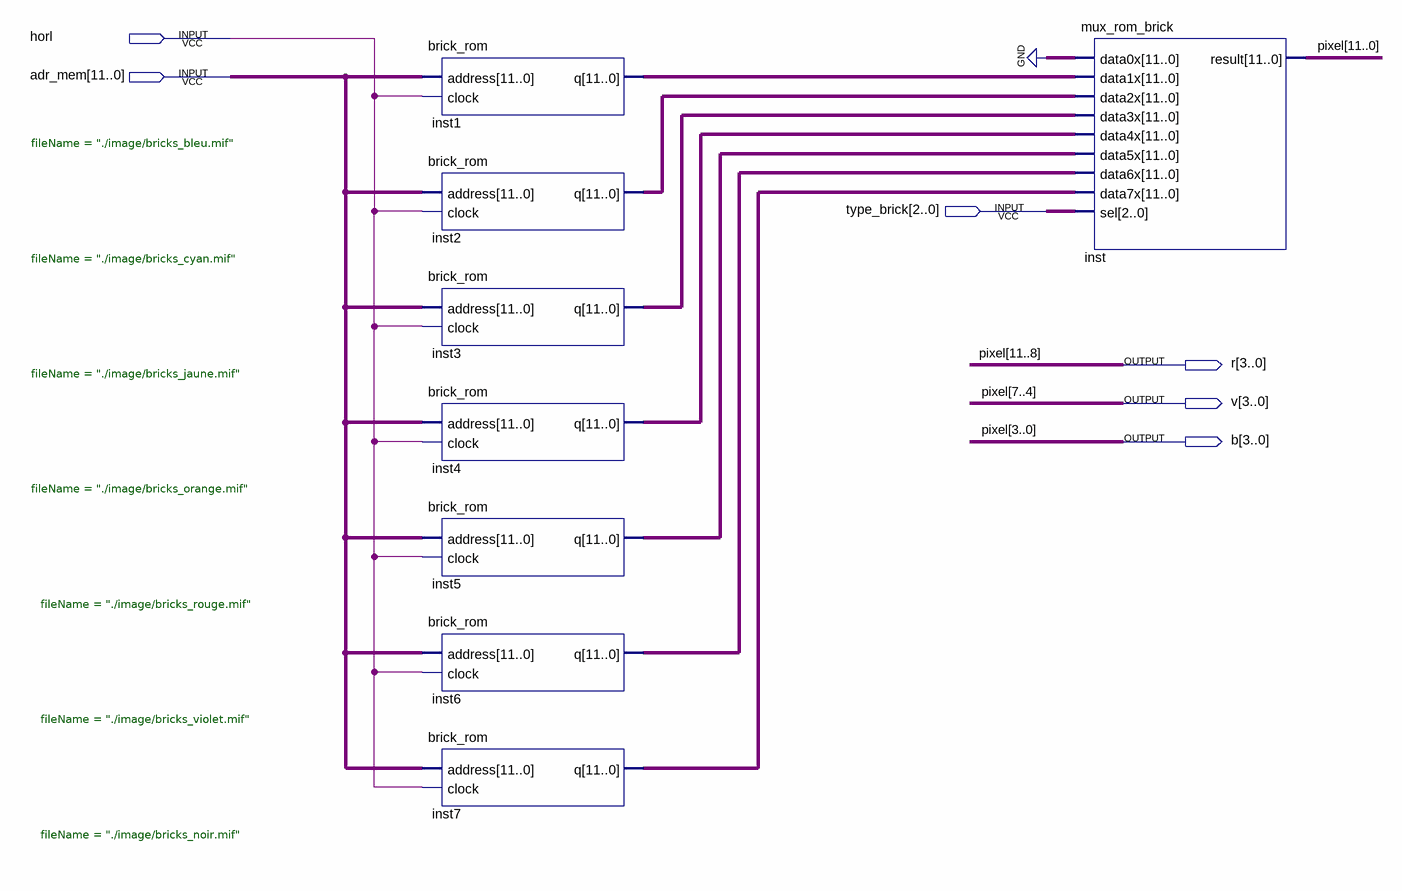
[diagram p0: schematic sheet]
// Quartus schematic memory_brick.bdf as structural Verilog: 8 symbols, 6 pins
module memory_brick (
  input  horl,
  input  [11:0] adr_mem,
  input  [2:0] type_brick,
  output [3:0] r,
  output [3:0] v,
  output [3:0] b
);

  wire [11:0] inst1_q, inst2_q, inst3_q, inst4_q, inst5_q, inst6_q, inst7_q;

  brick_rom #(.fileName("./image/bricks_bleu.mif")) inst1 (.address(adr_mem), .clock(horl), .q(inst1_q));
  brick_rom #(.fileName("./image/bricks_cyan.mif")) inst2 (.address(adr_mem), .clock(horl), .q(inst2_q));
  brick_rom #(.fileName("./image/bricks_jaune.mif")) inst3 (.address(adr_mem), .clock(horl), .q(inst3_q));
  brick_rom #(.fileName("./image/bricks_orange.mif")) inst4 (.address(adr_mem), .clock(horl), .q(inst4_q));
  brick_rom #(.fileName("./image/bricks_rouge.mif")) inst5 (.address(adr_mem), .clock(horl), .q(inst5_q));
  brick_rom #(.fileName("./image/bricks_violet.mif")) inst6 (.address(adr_mem), .clock(horl), .q(inst6_q));
  brick_rom #(.fileName("./image/bricks_noir.mif")) inst7 (.address(adr_mem), .clock(horl), .q(inst7_q));
  mux_rom_brick inst (
    .data0x({12{1'b0}}), .data1x(inst1_q), .data2x(inst2_q), .data3x(inst3_q), .data4x(inst4_q),
    .data5x(inst5_q), .data6x(inst6_q), .data7x(inst7_q), .sel(type_brick), .result({r, v, b}));

  // Other names for the same wires on the sheet: pixel[11:0] = {r, v, b}
endmodule
